# EasyEDA Pro project ProDoc_Schematic1_2025-03-25.epro

# Schematic Schematic1
Board Name: Board1; Create Date: 2025-03-25; Page Name: P1; Project Name: 7seg; Schematic Name: Schematic1; Update Date: 2025-03-25; Company: EasyEDA.com; Page Size: A4; Version: V1.0
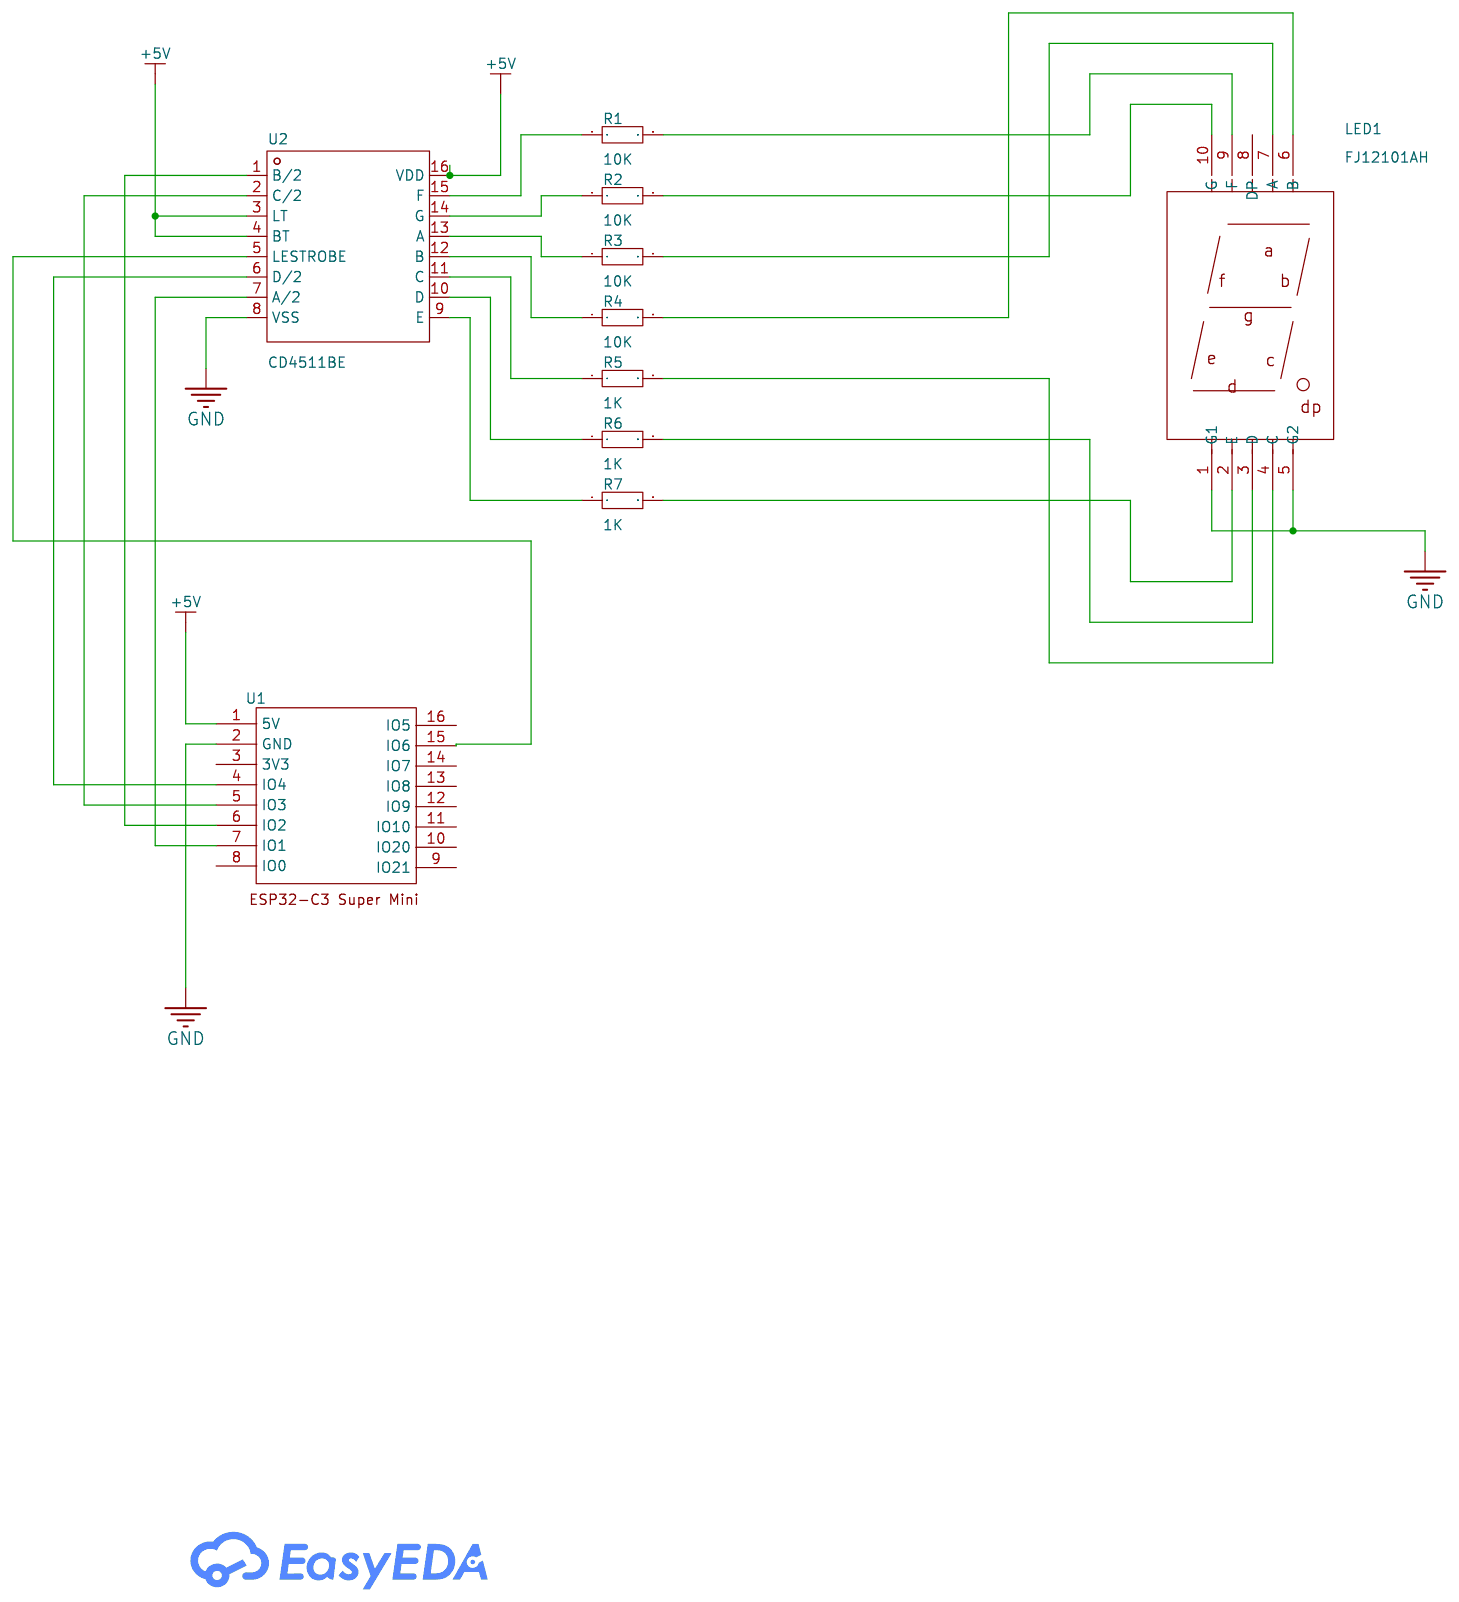
[diagram p0: schematic sheet]

## Parts
LED1  FJ12101AH  [LED-SEG-TH_10P-L28.8-W40.8-P2.54-S35.56-BL]
R1  10K  [R0603]
R2  10K  [R0603]
R3  10K  [R0603]
R4  10K  [R0603]
R5  1K  [R0603]
R6  1K  [R0603]
R7  1K  [R0603]
U1  -  [ESP32-C3 Super Mini]
U2  CD4511BE  [DIP-16_L19.8-W6.5-P2.54-LS7.6-BL]

## Library data of the parts
LED1 = FJ12101AH: Number of Characters:1Bit Luminous Color:Red LED Polarity:共阴极 Digit/Alpha Size(inch):1.2; LCSC Part Name: 1位1.2英寸红色数码管 共阴极; Supplier Part: C53679; Manufacturer: 志浩; Supplier Footprint: 插件; JLCPCB Part Class: Extended Part; Datasheet: https://atta.szlcsc.com/upload/public/pdf/source/20151111/1457707576612.pdf; Supplier: LCSC; Number of Characters: 1Bit; Luminous Color: Red; LED Polarity: 共阴极; Digit/Alpha Size(inch): 1.2
R1-R7 = Res_0603: Supplier Footprint: 0603
U1 = ESP32-C3 Super Mini
U2 = CD4511BE: Supplier Part: C5327; Manufacturer: TI(德州仪器); Supplier Footprint: DIP-16; JLCPCB Part Class: Extended Part; Datasheet: https://www.ti.com/cn/lit/gpn/cd4511b; Supplier: LCSC

## Nets
+5V: U1.1(5V) U2.3(LT) U2.4(BT) U2.16(VDD)
GND: LED1.1(G1) LED1.5(G2) U1.2(GND) U2.8(VSS)
Net-(LED1-2): LED1.2(E) R7.2
Net-(LED1-3): LED1.3(D) R6.2
Net-(LED1-4): LED1.4(C) R5.2
Net-(LED1-6): LED1.6(B) R4.2
Net-(LED1-7): LED1.7(A) R3.2
Net-(LED1-9): LED1.9(F) R1.2
Net-(LED1-10): LED1.10(G) R2.2
Net-(R1-1): R1.1 U2.15(F)
Net-(R2-1): R2.1 U2.14(G)
Net-(R3-1): R3.1 U2.13(A)
Net-(R4-1): R4.1 U2.12(B)
Net-(R5-1): R5.1 U2.11(C)
Net-(R6-1): R6.1 U2.10(D)
Net-(R7-1): R7.1 U2.9(E)
Net-(U1-4): U1.4(IO4) U2.6(D/2)
Net-(U1-5): U1.5(IO3) U2.2(C/2)
Net-(U1-6): U1.6(IO2) U2.1(B/2)
Net-(U1-7): U1.7(IO1) U2.7(A/2)
Net-(U1-15): U1.15(IO6) U2.5(LESTROBE)

Not connected (* = marked no-connect by the designer): LED1 8(DP); U1 3(3V3) 8(IO0) 9(IO21) 10(IO20) 11(IO10) 12(IO9) 13(IO8) 14(IO7) 16(IO5)
